# EAGLE design MAX31855-Breakout-Board (EAGLE 6.1)
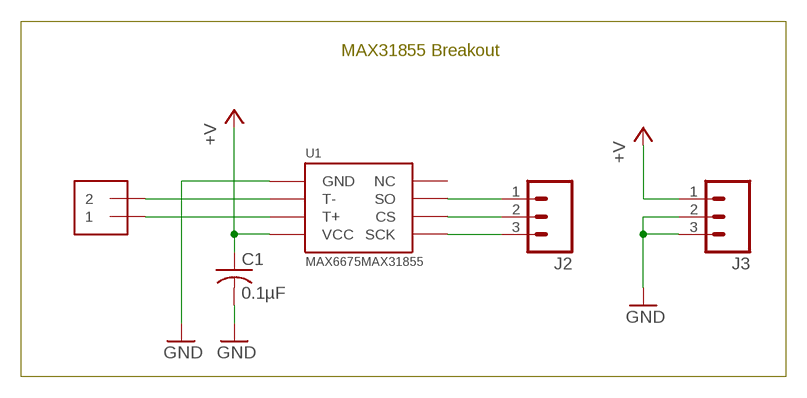
[diagram p0: schematic, sheet 1]

## Parts
C1  0.1µF  C-USC0603  [C0603]
J2  M031X03_NO_SILK  [1X03_NO_SILK]
J3  M031X03_NO_SILK  [1X03_NO_SILK]
J4  1X2-3.5MM  [1X2-3.5MM]
U1  MAX6675MAX31855  [SOIC-8]

## Nets
+5V: C1.1 J3.1 U1.VCC ; supply symbol labelled +V
CS: J2.2 U1.CS
GND: C1.2 J3.2 J3.3 U1.GND
SCK: J2.3 U1.SCK
SO: J2.1 U1.SO
T+: J4.1 U1.T+
T-: J4.2 U1.T-
Unconnected: U1.NC

## Notes on the sheet
- MAX31855 Breakout

## Library data of the parts
C1 = resistor:C-US: CAPACITOR, American symbol
J2 J3 = SparkFun:M03: Header 3 Standard 3-pin 0.1" header. Use with straight break away headers (SKU : PRT-00116), right angle break away headers (PRT-00553), swiss pins (PRT-00743), machine pins (PRT-00117), and female headers (PRT-00115). Molex polarized connector foot print use with SKU : PRT-08232 with associated crimp pins and housings.
J4 = adafruit:1X2: 3.5mm Terminal block http://www.ladyada.net/library/pcb/eaglelibrary.html
U1 = McLEng:MAX6675

## Board
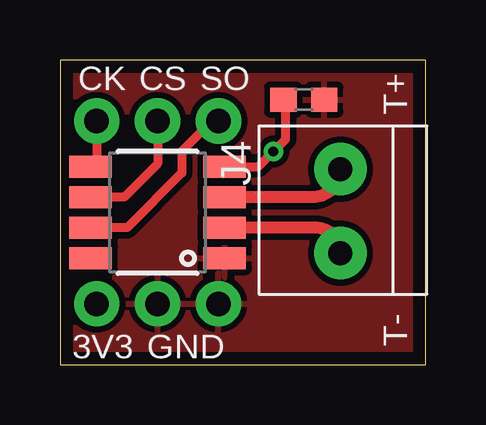
[diagram p1: board, top side]
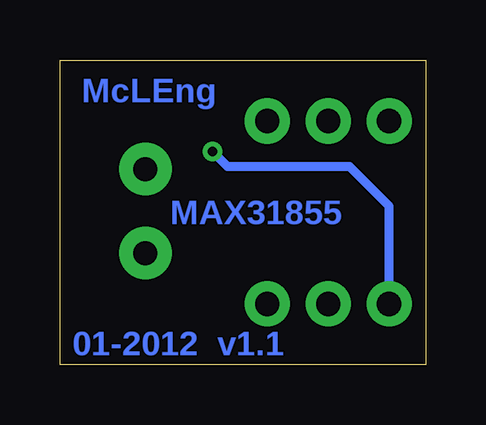
[diagram p2: board, bottom side, seen from below]

Size 15.24 x 12.7 mm. Coordinates in mm from the lower left corner, seen from the top.
Outline: 0,12.7 0,0 15.24,0 15.24,12.7 0,12.7
Copper layers (1*16): Top 0.035mm / dielectric 1.5mm / Bottom 0.035mm
Design rules: minimum track width 10mil, minimum drill 16mil, track to track 10mil, track to pad 10mil, pad to pad 8mil, via to via 8mil, smd to smd 8mil, copper to edge 20mil, drill to drill 10mil, minimum pad ring 10mil, minimum via ring 8mil, stop-mask expansion 4mil, vias tented up to drill 25mil, thermal gap 10mil

### Footprints (pad centres in the part's own frame; a part is rotated, then mirrored left to right if it is on the bottom)
C0603 = smd 1.1 x 1: 1 -0.85,0; 2 0.85,0
1X03_NO_SILK = drill 1.016 pad 1.88: 1 0,0; 2 2.54,0; 3 5.08,0
1X2-3.5MM = drill 1 pad 2.184: 1 1.8,0; 2 -1.7,0
SOIC-8 = smd 1.778 x 0.914: CS 2.794,-0.635; GND -2.794,1.905; NC 2.794,1.905; SCK 2.794,-1.905; SO 2.794,0.635; T+ -2.794,-0.635; T- -2.794,0.635; VCC -2.794,-1.905

### Placement (x,y rotation side)
C1  10.16,11.05 0 top
J2  6.6,10.16 180 top
J3  1.52,2.54 0 top
J4  11.68,6.35 90 top
U1  4.06,6.35 180 top

### Tracks (layer width: path | path; a pad name or v marks a point on that pad's centre or on a via)
+5V  (via drill 0.41 pad 0.81)
  Top 0.381: U1.VCC 8.26,8.26 v8.89,8.89 9.4,9.4 9.4,11.34 C1.1
  Bottom 0.381: J3.1 1.52,6.6 3.17,8.26 8.26,8.26 v8.89,8.89
CS
  Top 0.381: J2.2 4.06,8.38 2.67,6.99 U1.CS
GND
  pour Top: 0,0 0,12.7 15.24,12.7 15.24,0
SCK
  Top 0.381: J2.3 1.52,8.51 U1.SCK
SO
  Top 0.381: J2.1 6.35,10.16 5.08,8.89 5.08,8 2.79,5.71 U1.SO
T+
  Top 0.508: J4.1 arc-90 10.52,6.99 U1.T+
T-
  Top 0.508: J4.2 arc90 10.62,5.71 U1.T-

### Text on the board
Bottom: McLEng | MAX31855 | 01-2012 v1.1
tPlace: CK | CS | SO | T+ | 3V3 | GND | T-